# EAGLE design ardustatversion7op (EAGLE 5.11)
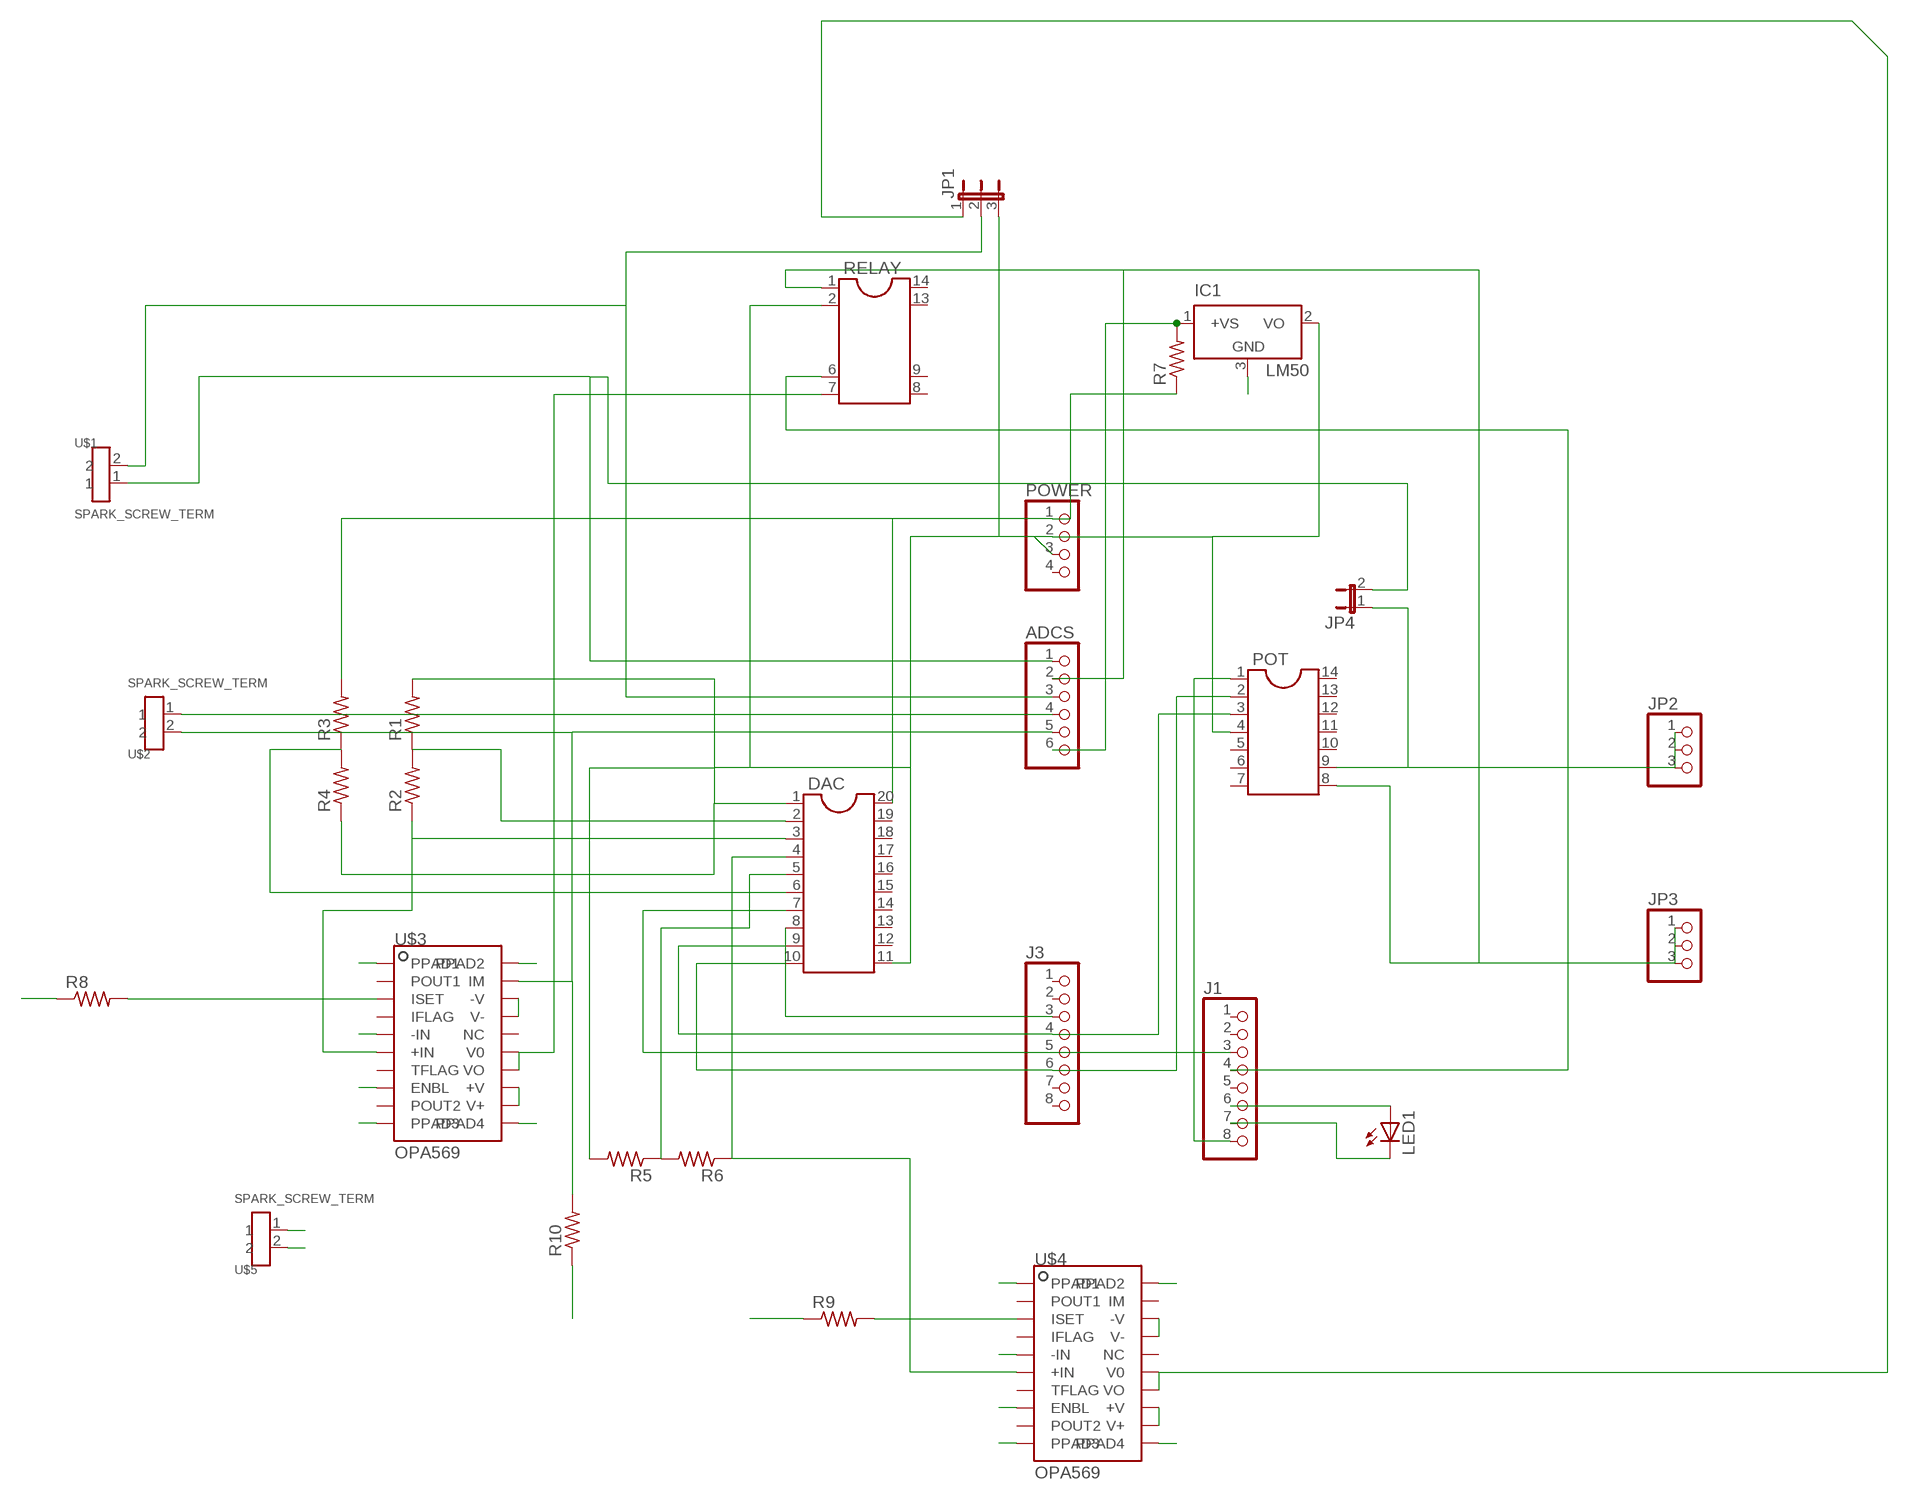
[diagram p0: schematic, sheet 1]

## Parts
ADCS  PINHD-1X6  [1X06]
DAC  DIL20S  [SOCKED-20]
IC1  LM50  [SOT23]
J1  PINHD-1X8  [1X08]
J3  PINHD-1X8  [1X08]
JP1  JP2E  [JP2]
JP2  PINHD-1X3  [1X03]
JP3  PINHD-1X3  [1X03]
JP4  JP1E  [JP1]
LED1  LED5MM  [LED5MM]
POT  DIL14S  [SOCKET-14]
POWER  PINHD-1X4  [1X04]
R1  R-US_0207/12  [0207/12]
R2  R-US_0207/12  [0207/12]
R3  R-US_0207/12  [0207/12]
R4  R-US_0207/12  [0207/12]
R5  R-US_0207/12  [0207/12]
R6  R-US_0207/12  [0207/12]
R7  R-US_0207/12  [0207/12]
R8  R-US_0207/12  [0207/12]
R9  R-US_0207/12  [0207/12]
R10  R-US_0207/12  [0207/12]
RELAY  DIL14/8  [DIL14/8]
U$1  SPARK_SCREW_TERM  [SPARK_SCREW_TERM]
U$2  SPARK_SCREW_TERM  [SPARK_SCREW_TERM]
U$3  OPA569  [OPA569]
U$4  OPA569  [OPA569]
U$5  SPARK_SCREW_TERM  [SPARK_SCREW_TERM]

## Nets
GND: DAC.1 DAC.11 IC1.2(VO) JP1.3 POT.4 POWER.2 POWER.3 R1.2 R4.1 R5.2 R8.1 R9.1 RELAY.2 U$3.P$1(PPAD1) U$3.P$10(PPAD3) U$3.P$11(PPAD4) U$3.P$17(V-) U$3.P$18(-V) U$3.P$20(PPAD2) U$4.P$1(PPAD1) U$4.P$10(PPAD3) U$4.P$11(PPAD4) U$4.P$17(V-) U$4.P$18(-V) U$4.P$20(PPAD2) U$5.2
N$1: DAC.6 R3.1 R4.2
N$2: DAC.10 J3.6 POT.2
N$3: DAC.9 J3.4 POT.3
N$4: DAC.8 J3.3
N$5: DAC.7 J1.3
N$6: J1.4 RELAY.6
N$7: DAC.2 R1.1 R2.2
N$8: ADCS.1 JP4.2 U$1.1
N$9: J1.8 POT.1
N$10: DAC.20 POWER.1 R3.2 R7.1 U$3.P$8(ENBL) U$4.P$8(ENBL)
N$11: ADCS.2 JP3.1 JP3.2 JP3.3 POT.8 RELAY.1
N$12: DAC.5 R5.1 R6.2
N$13: IC1.3(GND)
N$14: ADCS.5 R10.2 U$2.2 U$3.P$19(IM)
N$15: DAC.3 R2.1 U$3.P$6(+IN)
N$16: R9.2 U$4.P$3(ISET)
N$17: J1.6 LED1.A
N$18: J1.7 LED1.K(C)
N$19: ADCS.6 IC1.1(+VS) R7.2
N$20: ADCS.4 U$2.1
N$21: ADCS.3 JP1.2 U$1.2
N$22: U$3.P$12(V+) U$3.P$13(+V) U$4.P$12(V+) U$4.P$13(+V) U$5.1
N$23: JP2.1 JP2.2 JP2.3 JP4.1 POT.9
N$25: R8.2 U$3.P$3(ISET)
N$26: RELAY.7 U$3.P$5(-IN) U$3.P$14(VO) U$3.P$15(V0)
N$27: JP1.1 R10.1 U$4.P$5(-IN) U$4.P$14(VO) U$4.P$15(V0)
N$34: DAC.4 R6.1 U$4.P$6(+IN)
Unconnected: DAC.12 DAC.13 DAC.14 DAC.15 DAC.16 DAC.17 DAC.18 DAC.19 J1.1 J1.2 J1.5 J3.1 J3.2 J3.5 J3.7 J3.8 POT.5 POT.6 POT.7 POT.10 POT.11 POT.12 POT.13 POT.14 POWER.4 RELAY.8 RELAY.9 RELAY.13 RELAY.14 U$3.P$2(POUT1) U$3.P$4(IFLAG) U$3.P$7(TFLAG) U$3.P$9(POUT2) U$3.P$16(NC) U$4.P$2(POUT1) U$4.P$4(IFLAG) U$4.P$7(TFLAG) U$4.P$9(POUT2) U$4.P$16(NC) U$4.P$19(IM)

## Library data of the parts
ADCS = pinhead:PINHD-1X6: PIN HEADER
DAC = ic-package:DIL20: Dual In Line
IC1 = linear:LM50: SOT-23 Single-Supply Centigrade Temperature Sensor Vout = (10mV/°C x Temp °C) +5mmmV Source: http://cache.national.com/ds/LM/LM50.pdf
J1 J3 = pinhead:PINHD-1X8: PIN HEADER
JP1 = jumper:JP2E: JUMPER
JP2 JP3 = pinhead:PINHD-1X3: PIN HEADER
JP4 = jumper:JP1E: JUMPER
LED1 = led:LED: LED OSRAM: - CHIPLED LG R971, LG N971, LY N971, LG Q971, LY Q971, LO R971, LY R971 LH N974, LH R974 LS Q976, LO Q976, LY Q976 LO Q996 - Hyper CHIPLED LW Q18S LB Q993, LB Q99A, LB R99A - SideLED LS A670, LO A670, LY A670, LG A670, LP A670 LB A673, LV A673, LT A673, LW A673 LH A674 LY A675 LS A676, LA A676, LO A676, LY A676, LW A676 LS A679, LY A679, LG A679 - Hyper Micro SIDELED® LS Y876, LA Y876, LO Y876, LY Y876 LT Y87S - SmartLED LW L88C, LW L88S LB L89C, LB L89S, LG L890 LS L89K, LO L89K, LY L89K LS L896, LA L896, LO L896, LY L896 - TOPLED LS T670, LO T670, LY T670, LG T670, LP T670 LSG T670, LSP T670, LSY T670, LOP T670, LYG T670 LG T671, LOG T671, LSG T671 LB T673, LV T673, LT T673, LW T673 LH T674 LS T676, LA T676, LO T676, LY T676, LB T676, LH T676, LSB T676, LW T676 LB T67C, LV T67C, LT T67C, LS T67K, LO T67K, LY T67K, LW E67C LS E67B, LA E67B, LO E67B, LY E67B, LB E67C, LV E67C, LT E67C LW T67C LS T679, LY T679, LG T679 LS T770, LO T770, LY T770, LG T770, LP T770 LB T773, LV T773, LT T773, LW T773 LH T774 LS E675, LA E675, LY E675, LS T675 LS T776, LA T776, LO T776, LY T776, LB T776 LHGB T686 LT T68C, LB T68C - Hyper Mini TOPLED® LB M676 - Mini TOPLED Santana® LG M470 LS M47K, LO M47K, LY M47K Source: http://www.osram.convergy.de - LUMILED® LXK2-PW12-R00, LXK2-PW12-S00, LXK2-PW14-U00, LXK2-PW14-V00 LXK2-PM12-R00, LXK2-PM12-S00, LXK2-PM14-U00 LXK2-PE12-Q00, LXK2-PE12-R00, LXK2-PE12-S00, LXK2-PE14-T00, LXK2-PE14-U00 LXK2-PB12-K00, LXK2-PB12-L00, LXK2-PB12-M00, LXK2-PB14-N00, LXK2-PB14-P00, LXK2-PB14-Q00 LXK2-PR12-L00, LXK2-PR12-M00, LXK2-PR14-Q00, LXK2-PR14-R00 LXK2-PD12-Q00, LXK2-PD12-R00, LXK2-PD12-S00 LXK2-PH12-R00, LXK2-PH12-S00 LXK2-PL12-P00, LXK2-PL12-Q00, LXK2-PL12-R00 Source: www.luxeon.com
POT = ic-package:DIL14: Dual In Line / Socket
POWER = pinhead:PINHD-1X4: PIN HEADER
R1-R10 = rcl:R-US_: RESISTOR, American symbol
RELAY = ic-package:DIL14/8: Dual In Line
U$1 U$2 U$5 = ardustat:SPARK_SCREW_TERM
U$3 U$4 = ardustat:OPA569

## Board
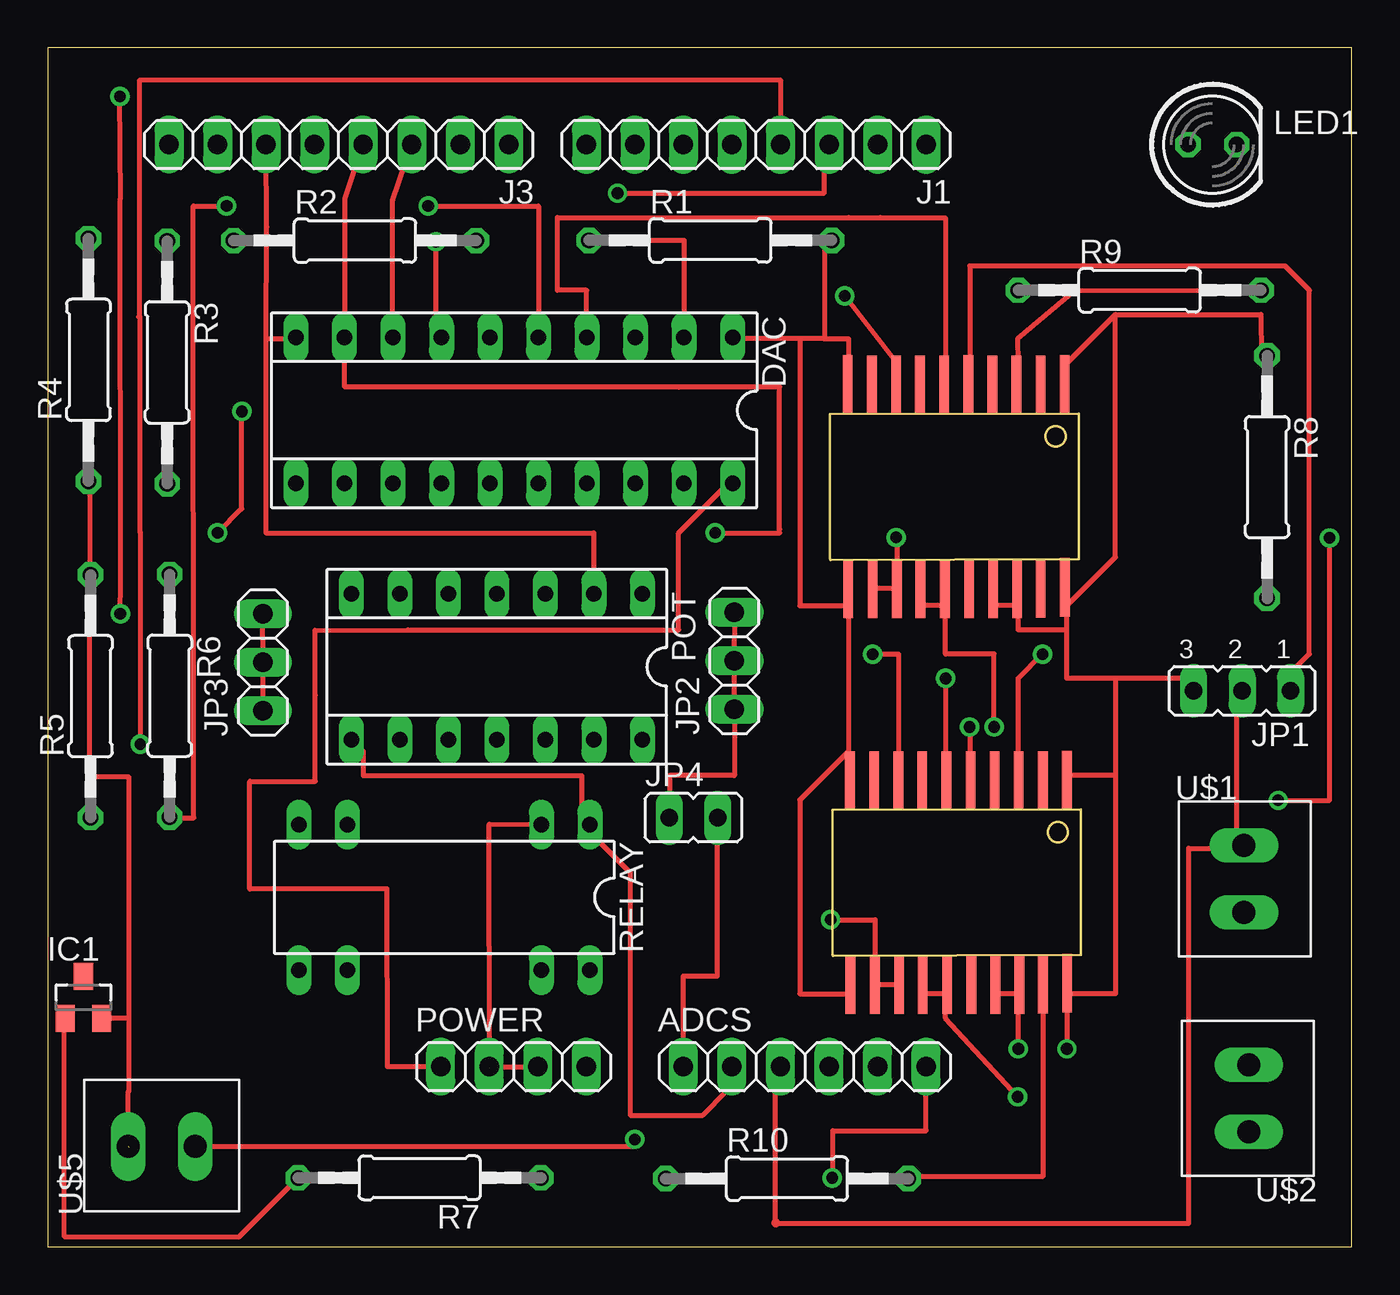
[diagram p1: board, top side]
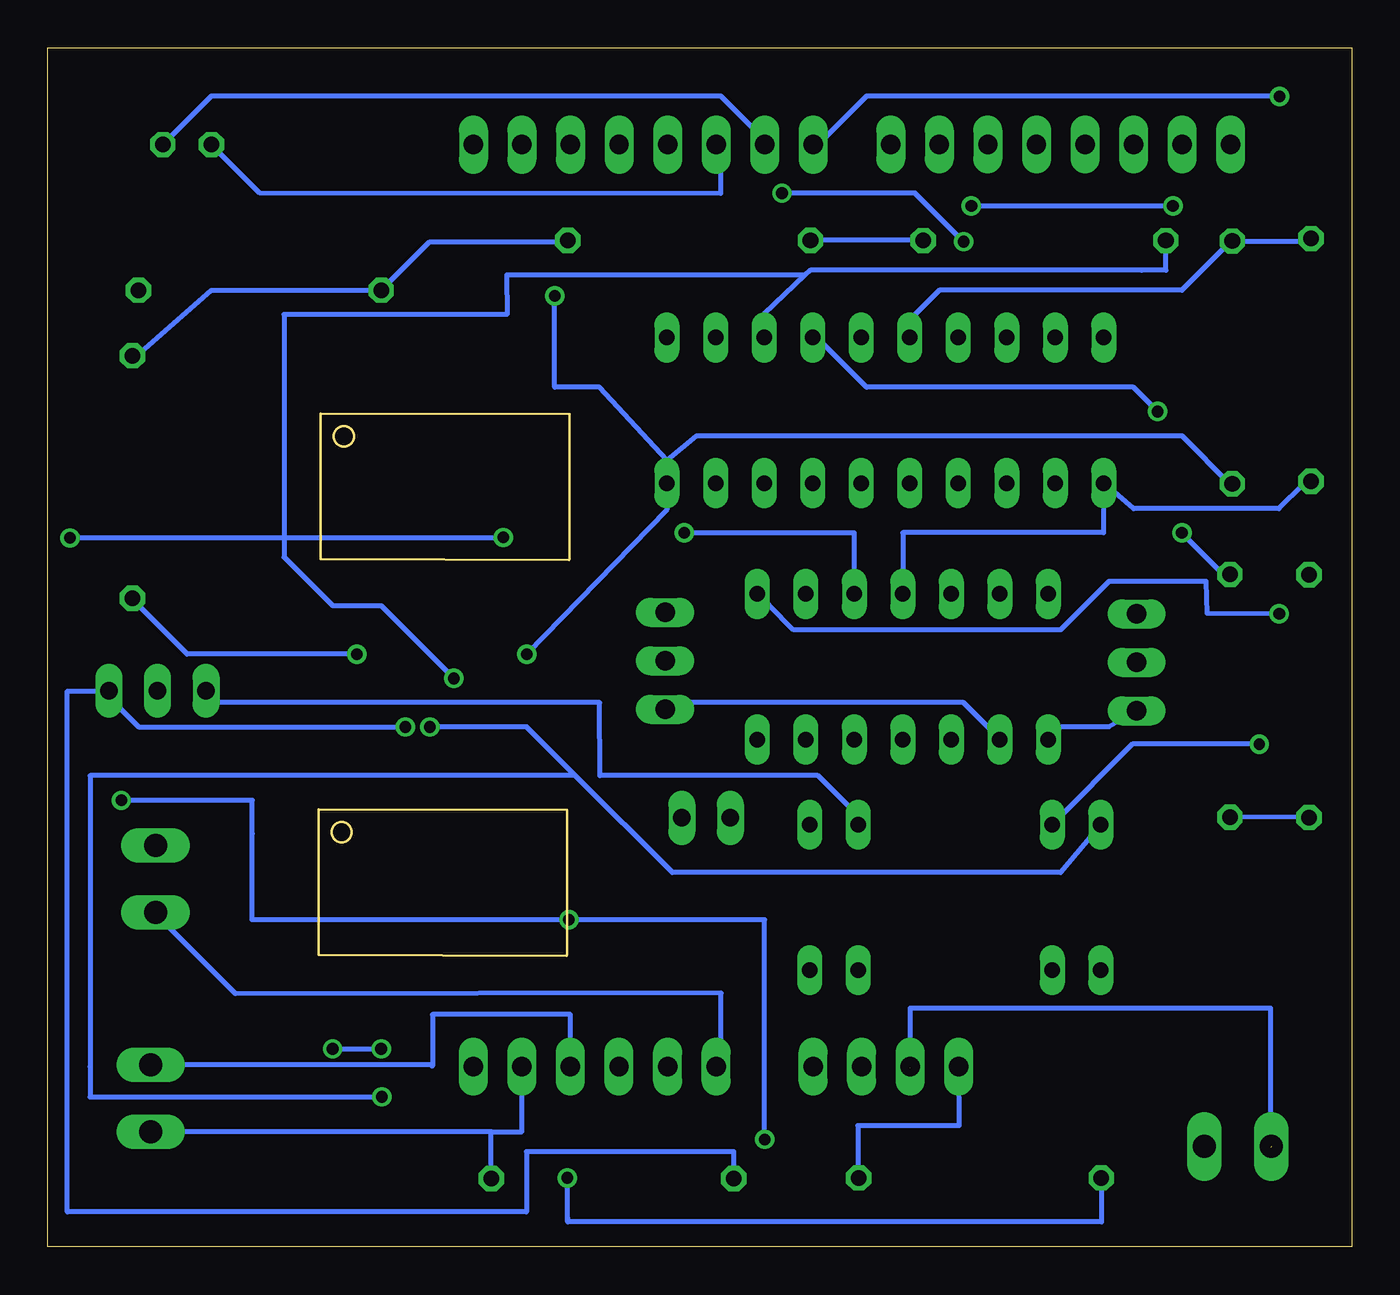
[diagram p2: board, bottom side, seen from below]

Size 68.25 x 62.76 mm. Coordinates in mm from the lower left corner, seen from the top.
Outline: 0,0 68.25,0 68.25,62.76 0,62.76 0,0
Copper layers (1*16): Top 0.035mm / dielectric 1.5mm / Bottom 0.035mm
Design rules "default": minimum track width 10mil, minimum drill 24mil, track to track 8mil, track to pad 8mil, pad to pad 8mil, via to via 8mil, smd to smd 8mil, copper to edge 40mil, drill to drill 8mil, minimum pad ring 10mil, minimum via ring 8mil, stop-mask expansion 4mil, vias tented up to drill 0mil, thermal gap 10mil

### Footprints (pad centres in the part's own frame; a part is rotated, then mirrored left to right if it is on the bottom)
1X06 = drill 1.016 long: 1 -6.35,0; 2 -3.81,0; 3 -1.27,0; 4 1.27,0; 5 3.81,0; 6 6.35,0
SOCKED-20 = drill 0.813 long: 1 -11.43,-3.81; 2 -8.89,-3.81; 3 -6.35,-3.81; 4 -3.81,-3.81; 5 -1.27,-3.81; 6 1.27,-3.81; 7 3.81,-3.81; 8 6.35,-3.81; 9 8.89,-3.81; 10 11.43,-3.81; 11 11.43,3.81; 12 8.89,3.81; 13 6.35,3.81; 14 3.81,3.81; 15 1.27,3.81; 16 -1.27,3.81; 17 -3.81,3.81; 18 -6.35,3.81; 19 -8.89,3.81; 20 -11.43,3.81
SOT23 = smd 1 x 1.4: 1 -0.95,-1.1; 2 0.95,-1.1; 3 0,1.1
1X08 = drill 1.016 long: 1 -8.89,0; 2 -6.35,0; 3 -3.81,0; 4 -1.27,0; 5 1.27,0; 6 3.81,0; 7 6.35,0; 8 8.89,0
JP2 = drill 0.914 long: 1 -2.54,0; 2 0,0; 3 2.54,0
1X03 = drill 1.016 long: 1 -2.54,0; 2 0,0; 3 2.54,0
JP1 = drill 0.914 long: 1 0,-1.27; 2 0,1.27
LED5MM = drill 0.813 octagon: A -1.27,0; K 1.27,0
SOCKET-14 = drill 0.813 long: 1 -7.62,-3.81; 2 -5.08,-3.81; 3 -2.54,-3.81; 4 0,-3.81; 5 2.54,-3.81; 6 5.08,-3.81; 7 7.62,-3.81; 8 7.62,3.81; 9 5.08,3.81; 10 2.54,3.81; 11 0,3.81; 12 -2.54,3.81; 13 -5.08,3.81; 14 -7.62,3.81
1X04 = drill 1.016 long: 1 -3.81,0; 2 -1.27,0; 3 1.27,0; 4 3.81,0
0207/12 = drill 0.813 octagon: 1 -6.35,0; 2 6.35,0
DIL14/8 = drill 0.813 long: 1 -7.62,-3.81; 2 -5.08,-3.81; 6 5.08,-3.81; 7 7.62,-3.81; 8 7.62,3.81; 9 5.08,3.81; 13 -5.08,3.81; 14 -7.62,3.81
SPARK_SCREW_TERM = drill 1.2 long: 1 0,-1.8; 2 0,1.7
OPA569 = smd 3.06 x 0.51: P$1 -5.34,5.72; P$2 -5.31,4.46; P$3 -5.32,3.2; P$4 -5.32,1.94; P$5 -5.33,0.68; P$6 -5.32,-0.58; P$7 -5.32,-1.85; P$8 -5.32,-3.09; P$9 -5.32,-4.36; P$10 -5.33,-5.63; P$11 5.35,-5.61; P$12 5.35,-4.32; P$13 5.35,-3.06; P$14 5.35,-1.83; P$15 5.35,-0.54; P$16 5.35,0.72; P$17 5.35,1.98; P$18 5.35,3.24; P$19 5.32,4.47; P$20 5.29,5.73

### Placement (x,y rotation side)
ADCS  39.62,9.43 0 top
DAC  24.41,43.78 180 top
IC1  1.87,13.06 0 top
J1  37.08,57.69 180 top
J3  15.24,57.69 180 top
JP1  62.51,29.11 180 top
JP2  35.94,30.67 90 top
JP3  11.26,30.59 90 top
JP4  33.79,22.45 270 top
LED1  60.96,57.69 0 top
POT  23.5,30.36 180 top
POWER  24.38,9.43 0 top
R1  34.68,52.68 0 top
R2  16.08,52.67 0 top
R3  6.25,46.29 270 top
R4  2.13,46.42 90 top
R5  2.24,28.82 90 top
R6  6.38,28.84 270 top
R7  19.46,3.61 180 top
R8  63.82,40.29 270 top
R9  57.15,50.07 0 top
R10  38.69,3.57 0 top
RELAY  20.76,18.29 180 top
U$1  62.61,19.3 0 top
U$2  62.86,7.73 180 top
U$3  47.62,19.08 270 top
U$4  47.5,39.8 270 top
U$5  5.92,5.25 90 top

### Tracks (layer width: path | path; a pad name or v marks a point on that pad's centre or on a via)
GND  (via drill 0.61)  (2 unrouted)
  Top 0.254: RELAY.2 25.4,22.13 23.1,22.11 23.12,9.38 POWER.2 POWER.3 | 4.25,11.88 4.26,8.41 4.26,8.16 4.22,8.12 U$5.2 | 4.25,11.88 4.26,20.5 4.26,20.83 4.26,24.59 2.2,24.59 2.2,34.8 2.21,34.99 | 2.21,34.99 2.21,40.07 R4.1 | 2.21,34.99 R5.2 | 50.8,33.56 49.53,33.56 U$4.P$17 | 50.8,13.24 49.53,13.24 U$3.P$17 | 55.88,29.75 53.34,29.75 53.34,32.29 | 55.88,29.75 59.69,29.75 JP1.3 | 53.34,32.29 53.34,33.56 | 53.34,13.24 55.88,13.24 55.88,24.67 | 55.88,29.75 55.88,24.67 | 55.88,24.67 53.34,24.67 U$3.P$1 | v50.8,10.36 50.8,13.24 | 53.34,13.24 v53.34,10.36 | 50.8,13.24 U$3.P$18 | 53.34,13.24 U$3.P$20 | 50.8,33.56 50.8,32.29 53.34,32.29 | 50.8,33.56 U$4.P$18 | 41.91,33.56 41.91,25.94 | 41.91,25.94 41.91,24.67 U$3.P$10 | 41.91,25.94 39.37,23.4 39.37,13.24 41.91,13.24 U$3.P$11 | 40.64,47.53 41.91,47.53 41.91,46.26 U$4.P$10 | 40.64,47.53 39.37,47.53 | 39.37,47.53 35.97,47.53 DAC.1 | 40.64,47.53 40.65,52.65 R1.2 | 55.88,48.8 53.34,46.26 U$4.P$1 | 55.88,48.8 63.5,48.8 63.51,46.62 R8.1 | 41.91,33.56 39.37,33.56 39.37,47.53 | 41.91,33.56 U$4.P$11 | 53.34,33.56 55.88,36.1 55.88,48.8 | 53.34,33.56 U$4.P$20 | IC1.2 4.25,11.96 4.25,11.88
  Bottom 0.254: 12.99,39.99 11.43,38.64 3.81,38.64 2.54,39.91 R4.1 | 12.99,39.99 13,37.38 23.5,37.38 POT.4 | 12.99,39.99 DAC.11 | v53.34,10.36 v50.8,10.36 | R1.2 40.64,52.61 48.26,52.61 R9.1 59.69,50.07 63.61,46.63 R8.1 | RELAY.2 25.4,22.13 27.94,24.67 39.35,24.67 39.36,28.48 59.69,28.48 JP1.3 | 4.17,5.2 4.24,5.2 4.24,12.49 23.12,12.49 23.12,9.37
N$1
  Bottom 0.254: 6.35,52.61 2.54,52.61 R4.2 | 6.35,52.61 8.89,50.07 21.59,50.07 22.86,48.8 DAC.6 | 6.35,52.61 R3.1
N$2
  Top 0.254: 11.43,47.53 11.47,53.38 J3.6 | 11.43,47.53 11.43,37.37 28.57,37.36 28.57,34.87 POT.2 | 11.43,47.53 12.7,47.53 DAC.10
N$3  (via drill 0.61)
  Top 0.254: J3.4 15.56,54.89 15.56,48.77 DAC.9 15.53,47.47 15.55,45 33.02,44.99 38.3,45 38.3,37.56 38.31,37.56 38.31,37.37 v34.94,37.37
  Bottom 0.254: v34.94,37.37 26.03,37.37 26.03,34.85 POT.3
N$4
  Top 0.254: J3.3 18.05,54.79 18.06,48.79 DAC.8
N$5  (via drill 0.61)
  Top 0.254: v20.32,52.61 20.32,48.8 DAC.7 | v29.82,55.15 40.64,55.15 40.64,57.69 J1.3
  Bottom 0.254: v20.32,52.61 22.86,55.15 v29.82,55.15
N$6  (via drill 0.6)
  Top 0.254: J1.4 38.35,61.09 4.81,61.09 4.81,48.68 | 4.81,48.68 4.75,48.68 | 4.81,48.68 4.84,48.68 4.84,37.41 4.85,37.41 4.85,26.31 v4.84,26.31
  Bottom 0.254: v4.84,26.31 11.47,26.31 RELAY.6
N$7
  Top 0.254: DAC.2 33.31,52.68 R1.1
  Bottom 0.254: R2.2 22.86,52.69 27.94,52.69 R1.1
N$8
  Top 0.254: 33.02,9.43 ADCS.1 33.27,14.18 35.05,14.18 JP4.2
  Bottom 0.254: U$1.1 62.23,17.05 58.42,13.24 33.01,13.28 33.02,9.43 ADCS.1
N$9  (via drill 0.61)
  Top 0.254: v3.79,33.13 3.81,34.83 3.79,54.87 3.81,54.89 v3.77,60.21
  Bottom 0.254: v3.79,33.13 7.56,33.15 7.62,34.83 12.7,34.83 15.24,32.29 29.21,32.29 30.48,33.56 POT.1 | v3.77,60.21 6.35,60.23 25.4,60.23 27.94,57.69 J1.8
N$10  (via drill 0.61)
  Top 0.254: 44.45,24.67 U$3.P$8 44.53,31.02 v43.18,31.02 | POWER.1 17.78,9.43 17.76,18.74 14,18.74 10.57,18.73 10.57,24.36 14,24.36 14,28.87 13.99,32.27 18.84,32.29 33.02,32.29 33.02,37.37 35.56,39.91 DAC.20 | v41.72,49.77 44.45,46.26 U$4.P$8
  Top 0.406: U$3.P$8 44.56,24.4
  Bottom 0.254: 35.84,41.19 34.29,42.45 8.89,42.45 6.35,39.91 R3.2 | v41.72,49.77 41.72,44.99 39.37,44.99 35.84,41.19 | 35.84,41.19 DAC.20 35.84,38.59 v43.18,31.02 | R7.1 25.85,3.61 25.85,6.34 20.54,6.34 POWER.1
N$11
  Top 0.254: 11.28,30.5 11.27,28.11 JP3.1 | 11.28,30.5 11.26,33.11 JP3.3 | 11.28,30.5 JP3.2 | 27.94,22.13 27.94,24.67 16.51,24.67 16.51,25.94 POT.8 | 27.94,22.13 30.48,19.59 30.48,6.89 34.29,6.89 35.56,8.16 35.56,9.43 ADCS.2 | 27.94,22.13 RELAY.1
  Bottom 0.254: JP3.1 11.29,28.03 12.7,27.21 15.24,27.21 POT.8
N$12  (via drill 0.61 pad 1.02)
  Top 0.254: R6.2 6.45,22.46 7.64,22.45 7.62,54.48 v9.36,54.48 | DAC.5 25.68,54.48 v19.91,54.48
  Bottom 0.254: R5.1 2.58,22.47 R6.2 | v9.36,54.48 v19.91,54.48
N$14
  Top 0.254: U$3.P$19 52.1,3.7 45.04,3.7 R10.2
  Bottom 0.254: R10.2 45.04,6.03 | 45.04,6.03 U$2.2 | 45.04,6.03 43.43,6.03 ADCS.5
N$15  (via drill 0.61)
  Top 0.254: v46.99,29.75 46.99,24.67 U$3.P$6
  Bottom 0.254: 28.62,50.86 30.77,48.83 DAC.3 | 28.62,50.86 28.34,51.11 10.99,51.12 9.73,51.12 R2.1 | v46.99,29.75 50.8,33.56 53.34,33.56 55.88,36.1 55.88,48.8 44.22,48.8 44.23,50.86 28.62,50.86
N$16
  Top 0.254: R9.2 53.72,50.04 50.78,47.55 50.8,46.26 U$4.P$3
N$17
  Bottom 0.254: LED1.A 57.15,55.15 33.02,55.13 33.02,57.69 J1.6
N$18
  Bottom 0.254: LED1.K 59.69,60.23 33.02,60.23 30.48,57.69 J1.7
N$19  (via drill 0.61)
  Top 0.254: v41.05,3.61 41.09,3.61 41.09,6.08 45.98,6.08 45.98,6.11 45.97,6.11 ADCS.6 | IC1.1 0.87,11.96 0.87,0.53 10.03,0.53 R7.2
  Bottom 0.254: R7.2 13.1,1.3 41.04,1.3 41.04,1.5 41.05,1.5 v41.05,3.61
N$20
  Bottom 0.254: U$2.1 48.16,9.53 48.16,9.47 48.12,9.47 48.12,12.16 40.89,12.16 ADCS.4
N$21
  Top 0.254: 62.23,20.86 62.23,28.48 JP1.2 | 62.23,20.86 59.72,20.86 59.72,1.22 38.1,1.22 38.1,1.3 38.1,9.43 ADCS.3 | 62.23,20.86 U$1.2
  Top 0.406: 38.1,1.21 38.1,1.3
N$22  (via drill 0.6)
  Top 0.254: U$3.P$13 U$3.P$12 43.3,17.12 v40.97,17.12 | U$4.P$12 U$4.P$13 44.44,37.13 v44.41,37.13 | U$5.1 30.73,5.25 v30.73,5.62 | v64.4,23.37 67.09,23.37 v67.09,37.1
  Bottom 0.254: v30.73,5.62 30.73,17.12 v40.97,17.12 57.56,17.12 57.56,21.63 57.55,21.63 57.55,23.37 v64.4,23.37 | v44.41,37.13 67.09,37.13 v67.09,37.1
N$23
  Top 0.254: JP2.3 35.96,33.18 JP2.2 JP2.1 35.94,24.66 32.54,24.66 32.54,22.45 JP4.1
  Bottom 0.254: POT.9 19.05,27.21 20.32,28.48 35.56,28.48 JP2.1
N$25  (via drill 0.61)
  Top 0.254: v52.07,31.02 50.8,29.75 50.8,24.67 U$3.P$3
  Bottom 0.254: v52.07,31.02 60.96,31.02 63.5,33.56 R8.2
N$26  (via drill 0.61)
  Top 0.254: 46.99,13.24 45.72,13.24 U$3.P$14 | v48.26,27.21 48.26,24.67 U$3.P$5 | 46.99,13.24 46.99,11.97 v50.77,7.85 | 46.99,13.24 U$3.P$15
  Bottom 0.254: 40.64,24.67 43.18,27.21 v48.26,27.21 | 40.64,24.67 35.56,19.59 15.24,19.59 13.17,22.07 RELAY.7 | v50.77,7.85 66.03,7.85 66.04,9.43 66.04,24.67 40.64,24.67
N$27  (via drill 0.61)
  Top 0.254: 46.99,33.56 45.72,33.56 U$4.P$14 | JP1.1 64.77,29.75 66.04,31.02 66.04,50.07 64.77,51.34 48.26,51.34 48.26,46.26 U$4.P$5 | 46.99,33.56 46.99,31.02 49.53,31.03 v49.53,27.21 | 46.99,33.56 U$4.P$15
  Bottom 0.254: v49.53,27.21 63.5,27.21 64.77,28.48 JP1.1 65.05,29.09 67.23,29.09 67.23,1.83 43.19,1.83 43.19,4.98 32.34,4.98 R10.1
N$34  (via drill 0.61)
  Top 0.254: v8.89,37.37 10.16,38.64 v10.16,43.72 | U$4.P$6 46.99,46.26 46.98,53.86 43.56,53.87 41.91,53.88 26.67,53.88 26.67,50.07 28.2,50.07 DAC.4
  Bottom 0.254: v8.89,37.37 6.35,34.83 R6.1 | v10.16,43.72 11.43,44.99 25.4,44.99 27.94,47.53 DAC.4